# Altium schematic sheet Power Supply.SchDoc
size Letter; DocumentNumber: 2; SheetNumber: 2; SheetTotal: 7
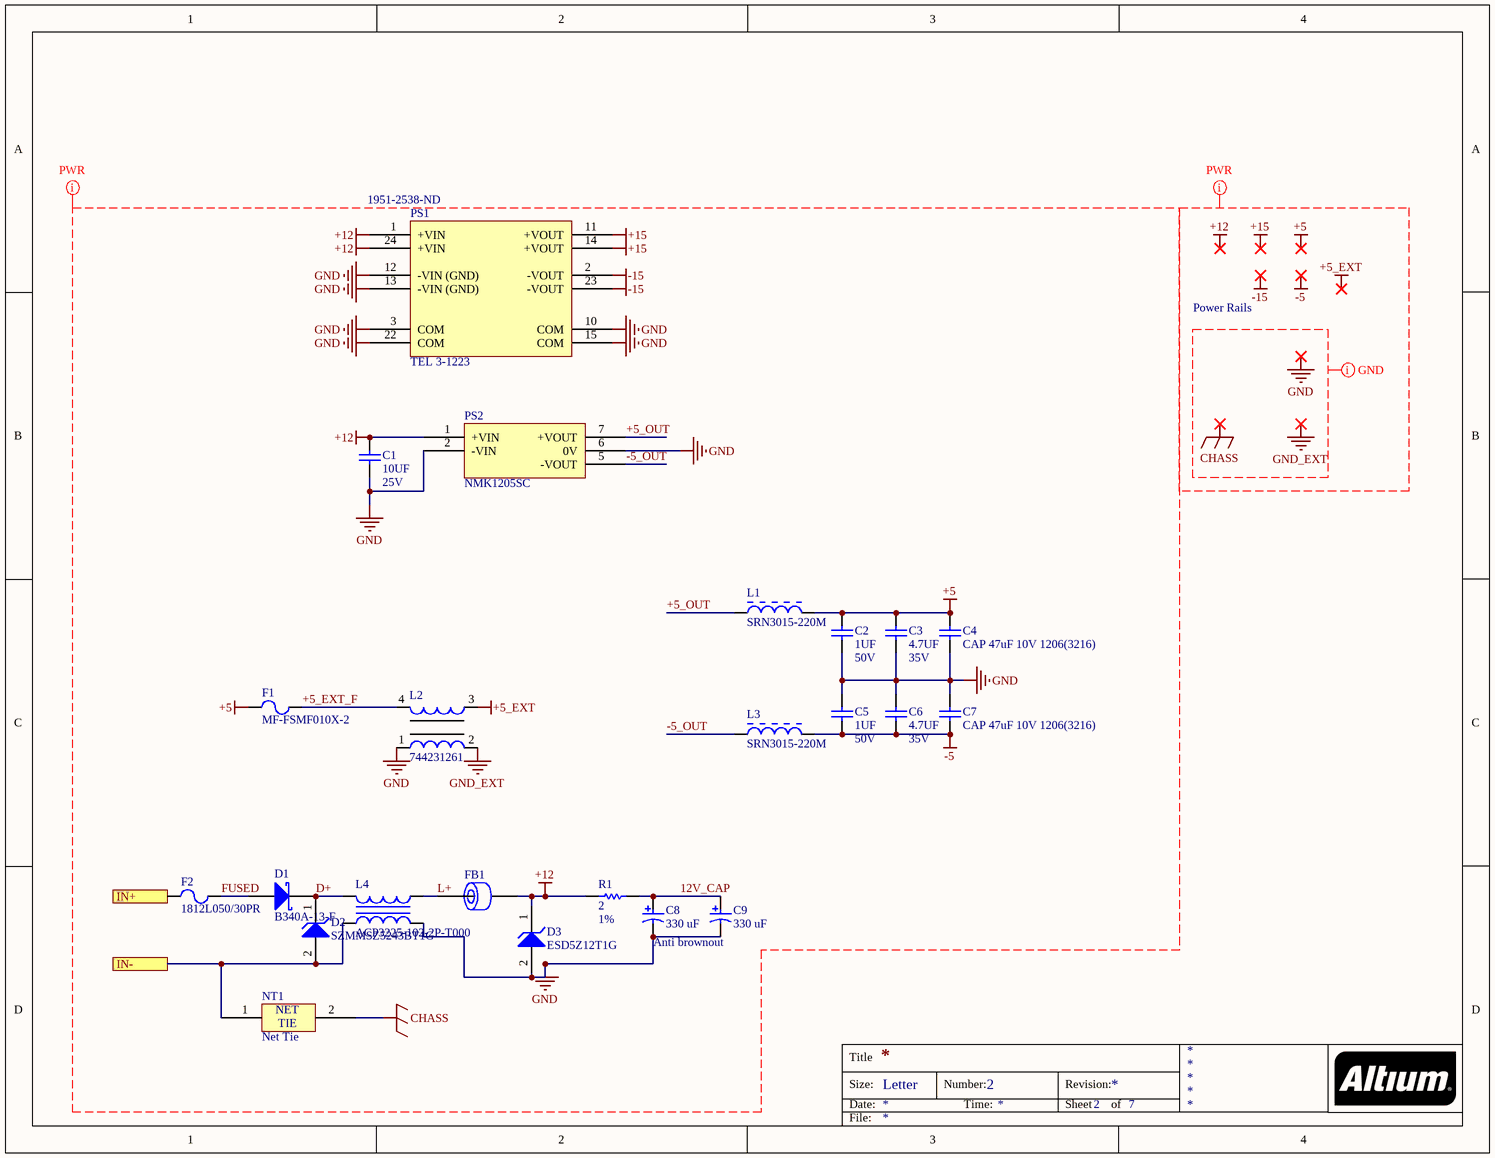
[diagram p0: Power Supply.SchDoc]

## Parts
C1  Val: 10UF  Vol: 25V  [0603_CAP]  (hidden comment: CAP 0603 10UF 25V 20% X5R)
C2  Val: 1UF  Vol: 50V  [0603_CAP]  (hidden comment: CAP 0603 1UF 50V 10% X7R)
C3  Val: 4.7UF  Vol: 35V  [0805_CAP]  (hidden comment: CAP 0805 4.7UF 35V 10% X7R)
C4  CAP 47uF 10V 1206(3216)  [CAPC1206(3216)190_N]
C5  Val: 1UF  Vol: 50V  [0603_CAP]  (hidden comment: CAP 0603 1UF 50V 10% X7R)
C6  Val: 4.7UF  Vol: 35V  [0805_CAP]  (hidden comment: CAP 0805 4.7UF 35V 10% X7R)
C7  CAP 47uF 10V 1206(3216)  [CAPC1206(3216)190_N]
C8  Rated Capacitance: 330 uF  [NIC-CAPA2-10X10_V]  (hidden comment: UUD1V331MNL1GS)
C9  Rated Capacitance: 330 uF  [NIC-CAPA2-10X10_V]  (hidden comment: UUD1V331MNL1GS)
D1  B340A-13-F  [DIOD-SMA-2_V]
D2  SZMMSZ5243BT1G  [ONSC-SOD-123-2-425-04_V]
D3  ESD5Z12T1G  [ONSC-SOD-523-2-502-01_V]
F1  MF-FSMF010X-2  [MF-FSMF]
F2  1812L050/30PR  [LFUS-1812L05030PR_V]
FB1  Ferrite Chip 1500 Ohms  [0805]  (value not drawn)
L1  SRN3015-220M  [BOUR-SRN3015-2_V]
L2  744231261  [WE-CNSW-0805]
L3  SRN3015-220M  [BOUR-SRN3015-2_V]
L4  ACP3225-102-2P-T000  [TDK-ACP3225-102-2P-T000-4_V]
NT1  Net Tie  [20MIL_TIE]  (net tie, no BOM)
PS1  TEL 3-1223  Supplier Part Number 1: 1951-2538-ND  [TEL 3-1223]
PS2  NMK1205SC  [NMV0505SC]
R1  Val: 2  Tol: 1%  [0805_RES]  (hidden comment: RES 0805 2 1%)

## Ports
IN+, IN-

## Nets
+5: C2.2 C3.2 C4.2 F1.1 L1.2
+5_EXT: L2.3
+12: C1.2 D3.1(K) FB1.2 PS1.1(+VIN) PS1.24(+VIN) PS2.1(+VIN) R1.1
+15: PS1.11(+VOUT) PS1.14(+VOUT)
-5: C5.1 C6.1 C7.1 L3.2
-15: PS1.2(-VOUT) PS1.23(-VOUT)
CHASS: NT1.2
GND: C1.1 C2.1 C3.1 C4.1 C5.2 C6.2 C7.2 C8.2 C9.2 D3.2(A) L2.1 L4.3 PS1.3(COM) PS1.10(COM) PS1.12(-VIN_(GND)) PS1.13(-VIN_(GND)) PS1.15(COM) PS1.22(COM) PS2.2(-VIN) PS2.6(0V)
GND_EXT: L2.2
12V_CAP: C8.1 C9.1 R1.2
+5_EXT_F: F1.2 L2.4
+5_OUT: L1.1 PS2.7(+VOUT)
-5_OUT: L3.1 PS2.5(-VOUT)
D+: D1.2(K) D2.1(K) L4.1
FUSED: D1.1(A) F2.2
IN+: F2.1 ; port IN+
IN-: D2.2(A) L4.2 NT1.1 ; port IN-
L+: FB1.1 L4.4

## Layout directives
net class GND_RAIL: CHASS, GND, GND_EXT
net class PWR; net class PWR_RAIL: +5, +5_EXT, +12, +15, -5, -15, CHASS, GND, GND_EXT
net class PWR: 12V_CAP, +5, +5_EXT, +5_EXT_F, +5_OUT, +12, +15, -5, -5_OUT, -15, CHASS, D+, FUSED, GND, GND_EXT, L+

## Notes on the sheet
- Power Rails
- Anti brownout
- Labels drawn without touching a wire or pin: +5, +5_EXT, +12, +15, -5, -15, CHASS, GND, GND_EXT
- Title
- Size:
- Date:
- Letter
- Number:
- Time:
- Revision:
- Sheet
- of
- File:
- (in symbol NET TIE) NET; TIE

## Library data of the parts
C1 = CAP 0603 10UF 25V 20% X5R: Capacitor Surface Mount 0603 Footprint 10UF 25V 20% Tolerance Ceramic X5R; Manufacturer: Various; PCB Package: 0603; Description in Visual: Cap SMT 0603 10UF 25V 20% Ceramic X5R; P/N: CAP 0603 10UF 25V 20% X5R; Manufacturer P/N: Various; Value: 10UF; Voltage: 25V; Tolerance: 20%; Type: Ceramic X5R; ComponentLink1Description: Manufacturer Website; ComponentLink2Description: Component Datasheet; ComponentLink3Description: Octopart Link
C2 C5 = CAP 0603 1UF 50V 10% X7R: Capacitor Surface Mount 0603 Footprint 1UF 50V 10% Tolerance Ceramic X7R; Manufacturer: Various; PCB Package: 0603; Description in Visual: Cap SMT 0603 1UF 50V 10% Ceramic X7R; P/N: CAP 0603 1UF 50V 10% X7R; Manufacturer P/N: Various; Value: 1UF; Voltage: 50V; Tolerance: 10%; Type: Ceramic X7R; ComponentLink1Description: Manufacturer Website; ComponentLink2Description: Component Datasheet; ComponentLink3Description: Octopart Link
C3 C6 = CAP 0805 4.7UF 35V 10% X7R: Capacitor Surface Mount 0805 Footprint 4.7UF 35V 10% Tolerance Ceramic X7R; Manufacturer: Various; PCB Package: 0805; Description in Visual: Cap SMT 0805 4.7UF 35V 10%  Cer X7R; P/N: CAP 0805 4.7UF 35V 10% X7R; Manufacturer P/N: Various; Value: 4.7UF; Voltage: 35V; Tolerance: 10%; Type: Ceramic X7R; ComponentLink1Description: Manufacturer Website; ComponentLink2Description: Component Datasheet; ComponentLink3Description: Octopart Link
C4 C7 = CMP-1037-05002-1: CAP 47uF 10V ±20% 1206 (3216 Metric) Thickness 1.9mm SMD; Case-Metric: 3216; Case-EIA: 1206; Tolerance: Â±20%; Technology: SMT; Rated Voltage: 10 V; Value: 47uF; Max Thickness: 1.9 mm
C8 C9 = CMP-0687-00008-1: Aluminum Electrolytic Capacitor, UD Series, Low Impedance, 330 uF, 35 V, + / - 20%, -55 to 105 degC, Chip Type, 10 x 10 mm D x L, Pb-Free, Reel; Manufacturer: Nichicon; Tolerance Rated Capacitance: -20 to 20%; Packing: Dia382mm Reel; Rated Voltage: 35 V; Rated Ripple Current (at 100kHz): 670 mA; Impedance: 0.09 Ohm; Endurance Time: 5000 h; Mounting Technology: Surface Mount; ComponentLink1Description: Manufacturer URL; PackageReference: CAPAE-D10H10; PartNumber: UUD1V331MNL1GS; ComponentLink2Description: Datasheet; Diameter: 10 mm; PackageDescription: 2-Pin Surface Mount Device, Diameter 10 mm, Height 10 mm, Pitch 8 mm; ComponentLink2URL: http://products.nichicon.co.jp/en/pdf/XJA043/e-ud.pdf; Length: 10 mm; ComponentLink3URL: http://products.nichicon.co.jp/en/pdf/XJA043/e-ud.pdf; DatasheetVersion: 08/2012; ComponentLink3Description: Package Specification; ComponentLink1URL: http://www.nichicon.co.jp/; RoHS: TRUE
D1 = CMP-1667-00003-1: Surface Mount Schottky Barrier Rectifier, 40 V, 3 A, -55 to 150 degC, 2-Pin SMA, RoHS, Tape and Reel; Forward Current: 3 A; Forward Voltage: 500 mV; Max Surge Current: 80 A; Peak Reverse Current: 500 uA; Elements: 1; Mounting Technology: Surface Mount; ComponentLink1URL: http://www.diodes.com/; PackageDescription: 2-Pin Surface Mounted Assembly, Body 4.3 x 2.605 mm, Height 2.4 mm; Min Operating Temperature: -55 degC; Mount: Surface Mount; Pins: 2; ComponentLink2URL: http://www.diodes.com/_files/datasheets/ds30891.pdf; PackageReference: SMA-2; Max Operating Temperature: 125 degC; Radiation Hardening: No; Length: 4.6 mm; RoHSCompliant: true; ComponentLink1Description: Manufacturer URL; Height: 2.1 mm; ComponentLink2Description: Datasheet; Packaging: Tape and Reel; Package Quantity: 5000; Case\Package: SMA; DatasheetVersion: Rev. 17 - 2, 09/2015; REACH SVHC: No SVHC; Width: 2.92 mm
D2 = CMP-1060-00481-1: Zener Voltage Regulator, 500 mW, 2-Pin SOD-123, Pb-Free, Tape and Reel; Manufacturer: On Semiconductor; VZ Typ (V): 13; P Max (W): 0.5; DatasheetVersion: Rev. 12; RoHS: Pb-Free; PartNumber: SZMMSZ5243BT1G; ComponentLink3Description: Package Specification; ComponentLink1URL: http://www.onsemi.com/; PackageReference: SOD-123-2-425-04; ComponentLink2Description: Datasheet; PackageVersion: Rev. G, 10/2009; Packing: Tape and Reel; Mounting Technology: Surface Mount; ComponentLink1Description: Manufacturer URL; PackageDescription: 2-Pin SOD, Body 1.6 x 2.69 mm; ComponentLink2URL: http://www.onsemi.cn/pub_link/Collateral/MMSZ5221BT1-D.PDF; ComponentLink3URL: http://www.onsemi.com/pub_link/Collateral/425-04.PDF
D3 = CMP-1063-00099-1: Transient Voltage Suppressor, Micro-Packaged Diode for ESD Protection, 2-Pin SOD-523, Pb-Free, Tape and Reel; Manufacturer: On Semiconductor; VRWM Max (V): 12; Number of Lines: 1; V(BR) Min (V): 14.1; Direction: Unidirectional; IR Max (uA): 0.01; PPK Max (W): 240; ComponentLink1URL: http://www.onsemi.com/; PartNumber: ESD5Z12T1G; RoHS: Pb-Free; ComponentLink3Description: Package Specification; PackageVersion: Rev. E, 09/2010; PackageReference: SOD-523-2-502-01; PackageDescription: 2-Pin SOD, Body 1.2 x 0.8 mm; ComponentLink2Description: Datasheet; ComponentLink1Description: Manufacturer URL; Mounting Technology: Surface Mount; DatasheetVersion: Rev. 10; ComponentLink3URL: http://www.onsemi.com/pub_link/Collateral/502-01.PDF; ComponentLink2URL: http://www.onsemi.cn/pub_link/Collateral/ESD5Z2.5T1-D.PDF; Packing: Tape and Reel
F1 = MF-FSMF010X-2: Polymeric PTC Resettable Fuse 15V 100mA Ih Surface Mount 0603 (1608 Metric), Concave; Supplier 1: Digi-Key; Supplier Part Number 1: MF-FSMF010X-2CT-ND
F2 = 1812L050/30PR: PTC Resettable Fuse, 0.8 W, 30 V, -40 to 85 degC, 2-Pin SMD, RoHS, Tape and Reel; Manufacturer: Littelfuse-Inc.; Manufacturer 1: Littelfuse; Voltage - Max: 30V; Current - Hold (Ih) (Max): 500mA; Time to Trip: 0.15s; Current - Max: 100A; R Min/Max: 0.150~1.000Ohm; Current - Trip (It): 1A; Package Reference: 1812; Family: PTCResettableFuses; Packaging: Tape&Reel(TR); Package / Case: 1812(4532Metric),Concave; Series: POLY-FUSE®,1812L; Mounting Technology: SurfaceMount; Datasheet Version: 02/2016; Datasheet URL: http://www.littelfuse.com/~/media/electronics/datasheets/resettable_ptcs/littelfuse_ptc_1812l_datasheet.pdf.pdf; Manufacturer URL: http://www.littelfuse.com/; Category: CircuitProtection; Package Description: 2-Pin Surface Mount Device, Body 4.55 x 3.24 mm; Manufacturer Part Number 1: 1812L050/30PR
FB1 = 742792097: Ferrite Chip 1000 mA 1500 Ohms Differential Mode - Single 0805 Footprint; Manufacturer: Wurth Electronics; Description in Visual: Ferrite SMT 1000mA 1500Ohm Dif Mode 0805; Usage: Power Supply; Current (mA): 1000; Frequency: 100 MHz; Impedance at Freq (ohms): 1500; DC Resistance (ohms): 0.3; P/N: 742792097; Manufacturer P/N: 742792097; Filter type: Differential Mode - Single; Operating Temperature Range: -55 to +125 °C; PCB Package: 0805; ComponentLink1Description: Manufacturer Website; ComponentLink1URL: http://www.we-online.com; ComponentLink2Description: Component Datasheet; ComponentLink2URL: http://www.we-online.com/eisos/pdf/742792097.pdf; ComponentLink3Description: Octopart Link; ComponentLink3URL: http://octopart.com/partsearch/#search/requestData&q=742792097
L1 L3 = CMP-0007-00013-1: Semi-shielded Power Inductor, 22 uH, +/- 20%, 0.6 A, -40 to 125 degC, 3 x 3 x 1.5 mm SMD, RoHS and Halogen Free, Tape and Reel; Manufacturer: Bourns; SRF Min: 28 MHz; Isat: 0.58 A; Resistance to Solder Heat: +260 degC for 10 sec.; Inductance tolerance: +/- 20%; Inductance: 22 uH; Rated current: 0.6 A; DCR Max: 0.622 Ohm; RoHS: TRUE; ComponentLink1Description: Manufacturer URL; ComponentLink3URL: http://www.bourns.com/data/global/pdfs/SRN3015.pdf; PartNumber: SRN3015-220M; DatasheetVersion: Aug-11; Mounting Technology: Surface Mount; ComponentLink3Description: Package Specification; ComponentLink2Description: Datasheet; Operating Temperature: -40 to 125 degC; PackageDescription: 2-Pin SMD, Body 3 x 3 mm, Height 1.5 mm; Packing: Tape and Reel; PackageReference: SRN3015; ComponentLink2URL: http://www.bourns.com/data/global/pdfs/SRN3015.pdf; ComponentLink1URL: http://www.bourns.com/
L2 = CMP-0222-00041-1: SMD Common Mode Noise Suppressor WE-CNSW, Z = 260 Ohm; Impedance: 260 Ohm; ComponentLink1URL: http://www.we-online.com; PackageDescription: SMD Inductor, 4-Leads, Body 1.4 x 2.2 mm; PackageVersion: 2010; ComponentLink2Description: Datasheet; DatasheetVersion: ver 4, Nov-2010; ComponentLink1Description: Manufacturer Link; PackageReference: WE-CNSW-0805; ComponentLink2URL: http://www.we-online.de/katalog/media/pdf/744231261.pdf
L4 = ACP3225-102-2P-T000: Common Mode Filter, 1000 Ohm Impedance, 1.2 A, 60 V, -40 to 85 degC, 4-Pin SMD, RoHS, Tape and Reel; Manufacturer: TDK; Online Catalog: ACPSeries; Other Names: 445-8637-6; Current: 1.5A; Featured Product: ACP3225SeriesFilter; Number of Lines: 2; Filter Type: PowerLine; Impedance: 1kOhm; DC Resistance (DCR): 50mOhm; Manufacturer URL: http://www.tdk.com/; Package Description: 4-Pin Surface Mount Device, Body 3.2 x 2.5 mm, Pitch 1.15 mm; Datasheet Version: Rev. 8, 07/2011; Package / Case: 1210(3225Metric),4Lead; Packaging: Digi-Reel; Inductance: -; Height (Max): 0.079"(2.00mm); Operating Temperature: -40degC~85degC; Size / Dimension: 0.126"Lx0.098"W(3.20mmx2.50mm); Datasheet URL: https://datasheet.ciiva.com/30106/acp3225-series-30106482.pdf; Standard Package: 1; Series: ACP; Mounting Type: SurfaceMount; Package Reference: ACP3225-102-2P-T000-4; Family: CommonModeChokes; Category: Filters; Manufacturer 1: TDK; Manufacturer Part Number 1: ACP3225-102-2P-T000
NT1 = NET TIE: Net Tie (No BOM)
PS1 = TEL 3-1223: Isolated Module DC DC Converter 2 Output 15V -15V   100mA, 100mA 9V - 18V Input; Supplier 1: Digi-Key
PS2 = NMK1205SC: Isolated Module DC DC Converter 2 Output 5V -5V   200mA, 200mA 10.8V - 13.2V Input; Supplier 1: Digi-Key; Supplier Part Number 1: 811-3393-5-ND
R1 = RES 0805 2 1%: Resistor Surface Mount, 2 Ohms, 0805 Footprint, 1% Tolerance 0.125W; Manufacturer: Various; PCB Package: 0805; Description in Visual: Res SMT 2 0805  1%  0.125W; Value: 2; P/N: RES 0805 2 1%; Manufacturer P/N: Various; Power_Rating: 0.125W; Tolerance: 1%